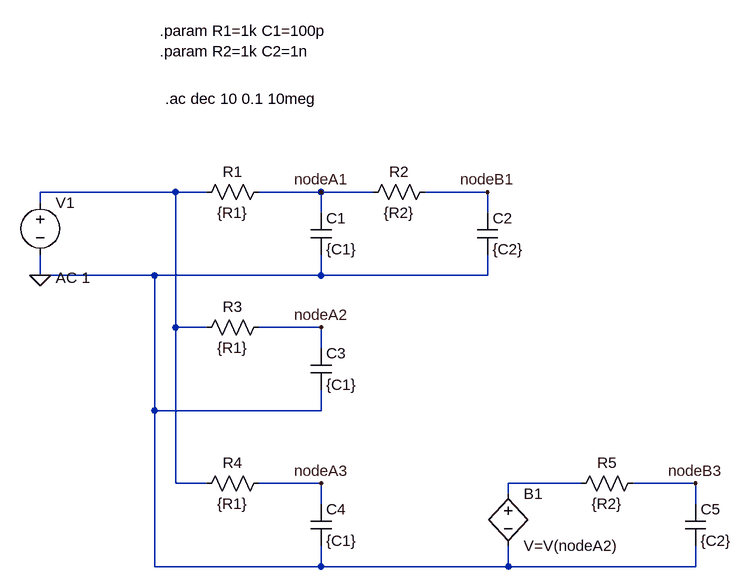
[diagram p0: schematic Draft2.asc]
Draft2.asc, the LTspice schematic file:
Version 4
SHEET 1 880 1436
WIRE -16 96 -224 96
WIRE 32 96 -16 96
WIRE 208 96 112 96
WIRE 288 96 208 96
WIRE 464 96 368 96
WIRE -224 112 -224 96
WIRE 208 128 208 96
WIRE 464 128 464 96
WIRE -224 224 -224 192
WIRE -48 224 -224 224
WIRE 208 224 208 192
WIRE 208 224 -48 224
WIRE 464 224 464 192
WIRE 464 224 208 224
WIRE -16 304 -16 96
WIRE 32 304 -16 304
WIRE 208 304 112 304
WIRE 208 336 208 304
WIRE -48 432 -48 224
WIRE 208 432 208 400
WIRE 208 432 -48 432
WIRE -16 544 -16 304
WIRE 32 544 -16 544
WIRE 208 544 112 544
WIRE 608 544 496 544
WIRE 784 544 688 544
WIRE 496 560 496 544
WIRE 208 576 208 544
WIRE 784 576 784 544
WIRE -48 672 -48 432
WIRE 208 672 208 640
WIRE 208 672 -48 672
WIRE 496 672 496 640
WIRE 496 672 208 672
WIRE 784 672 784 640
WIRE 784 672 496 672
FLAG 208 96 nodeA1
FLAG 464 96 nodeB1
FLAG -224 224 0
FLAG 208 304 nodeA2
FLAG 208 544 nodeA3
FLAG 784 544 nodeB3
SYMBOL cap 192 128 R0
SYMATTR InstName C1
SYMATTR Value {C1}
SYMBOL voltage -224 96 R0
WINDOW 123 24 132 Left 2
WINDOW 39 0 0 Left 0
SYMATTR Value2 AC 1
SYMATTR InstName V1
SYMATTR Value ""
SYMBOL res 128 80 R90
WINDOW 0 0 56 VBottom 2
WINDOW 3 32 56 VTop 2
SYMATTR InstName R1
SYMATTR Value {R1}
SYMBOL cap 448 128 R0
SYMATTR InstName C2
SYMATTR Value {C2}
SYMBOL res 384 80 R90
WINDOW 0 0 56 VBottom 2
WINDOW 3 32 56 VTop 2
SYMATTR InstName R2
SYMATTR Value {R2}
SYMBOL cap 192 336 R0
SYMATTR InstName C3
SYMATTR Value {C1}
SYMBOL res 128 288 R90
WINDOW 0 0 56 VBottom 2
WINDOW 3 32 56 VTop 2
SYMATTR InstName R3
SYMATTR Value {R1}
SYMBOL cap 192 576 R0
SYMATTR InstName C4
SYMATTR Value {C1}
SYMBOL res 128 528 R90
WINDOW 0 0 56 VBottom 2
WINDOW 3 32 56 VTop 2
SYMATTR InstName R4
SYMATTR Value {R1}
SYMBOL cap 768 576 R0
SYMATTR InstName C5
SYMATTR Value {C2}
SYMBOL res 704 528 R90
WINDOW 0 0 56 VBottom 2
WINDOW 3 32 56 VTop 2
SYMATTR InstName R5
SYMATTR Value {R2}
SYMBOL bv 496 544 R0
SYMATTR InstName B1
SYMATTR Value V=V(nodeA2)
TEXT -40 -152 Left 2 !.param R1=1k C1=100p\n.param R2=1k C2=1n
TEXT -32 -48 Left 2 !.ac dec 10 0.1 10meg

The netlist it stands for:
* Draft2.asc
C1 nodeA1 0 {C1}
V1 N001 0 AC 1
R1 nodeA1 N001 {R1}
C2 nodeB1 0 {C2}
R2 nodeB1 nodeA1 {R2}
C3 nodeA2 0 {C1}
R3 nodeA2 N001 {R1}
C4 nodeA3 0 {C1}
R4 nodeA3 N001 {R1}
C5 nodeB3 0 {C2}
R5 nodeB3 N002 {R2}
B1 N002 0 V=V(nodeA2)
.param R1=1k C1=100p
.param R2=1k C2=1n
.ac dec 10 0.1 10meg
.backanno
.end